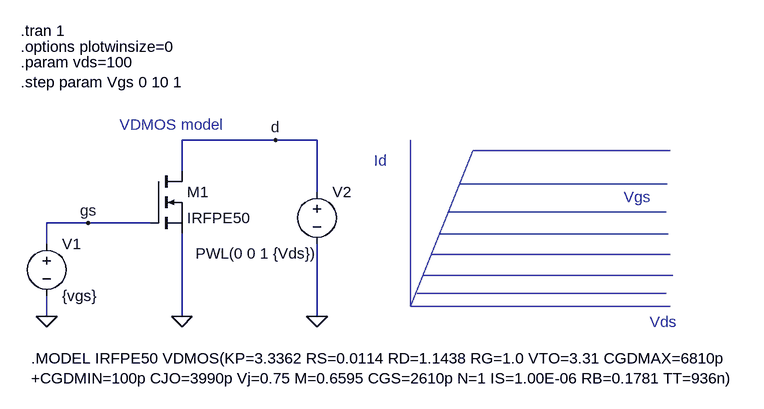
[diagram p0: schematic IRFPE50_Id(Vds,Vgs).asc]
IRFPE50_Id(Vds,Vgs).asc, the LTspice schematic file:
Version 4
SHEET 1 2828 1468
WIRE 256 400 112 400
WIRE 320 400 256 400
WIRE 112 448 112 400
WIRE 320 480 320 400
WIRE -32 528 -96 528
WIRE 64 528 -32 528
WIRE -96 560 -96 528
WIRE -96 672 -96 640
WIRE 112 672 112 544
WIRE 320 672 320 560
FLAG -96 672 0
FLAG 112 672 0
FLAG -32 528 gs
FLAG 256 400 d
FLAG 320 672 0
SYMBOL voltage -96 544 R0
WINDOW 123 0 0 Left 0
WINDOW 39 0 0 Left 0
SYMATTR InstName V1
SYMATTR Value {vgs}
SYMBOL voltage 320 464 R0
WINDOW 123 0 0 Left 0
WINDOW 39 0 0 Left 0
WINDOW 3 -187 111 Left 0
SYMATTR InstName V2
SYMATTR Value PWL(0 0 1 {Vds})
SYMBOL NMOS 64 448 R0
SYMATTR InstName M1
SYMATTR Value IRFPE50
TEXT -136 232 Left 0 !.tran 1
TEXT 408 432 Left 0 ;Id
TEXT 832 680 Left 0 ;Vds
TEXT -136 256 Left 0 !.options plotwinsize=0
TEXT 16 376 Left 0 ;VDMOS model
TEXT -136 280 Left 0 !.param vds=100\n.step param Vgs 0 10 1
TEXT -120 736 Left 0 !.MODEL IRFPE50 VDMOS(KP=3.3362 RS=0.0114 RD=1.1438 RG=1.0 VTO=3.31 CGDMAX=6810p\n+CGDMIN=100p CJO=3990p Vj=0.75 M=0.6595 CGS=2610p N=1 IS=1.00E-06 RB=0.1781 TT=936n)
TEXT 792 488 Left 0 ;Vgs
LINE Normal 464 656 464 400
LINE Normal 864 656 464 656
LINE Normal 584 656 472 656
LINE Normal 560 416 464 656
LINE Normal 864 416 560 416
LINE Normal 859 468 539 468
LINE Normal 858 511 522 511
LINE Normal 861 545 509 545
LINE Normal 864 576 496 576
LINE Normal 868 609 484 609
LINE Normal 858 636 474 636

The netlist it stands for:
* IRFPE50_Id(Vds,Vgs).asc
V1 gs 0 {vgs}
V2 d 0 PWL(0 0 1 {Vds})
M1 d gs 0 0 IRFPE50
.model NMOS NMOS
.model PMOS PMOS
.lib standard.mos
.tran 1
* Id
* Vds
.options plotwinsize=0
* VDMOS model
.param vds=100
.step param Vgs 0 10 1
.MODEL IRFPE50 VDMOS(KP=3.3362 RS=0.0114 RD=1.1438 RG=1.0 VTO=3.31 CGDMAX=6810p
+CGDMIN=100p CJO=3990p Vj=0.75 M=0.6595 CGS=2610p N=1 IS=1.00E-06 RB=0.1781 TT=936n)
* Vgs
.backanno
.end